# Altium schematic sheet Microphone.SchDoc
size A3; SheetNumber: 4; SheetTotal: 7
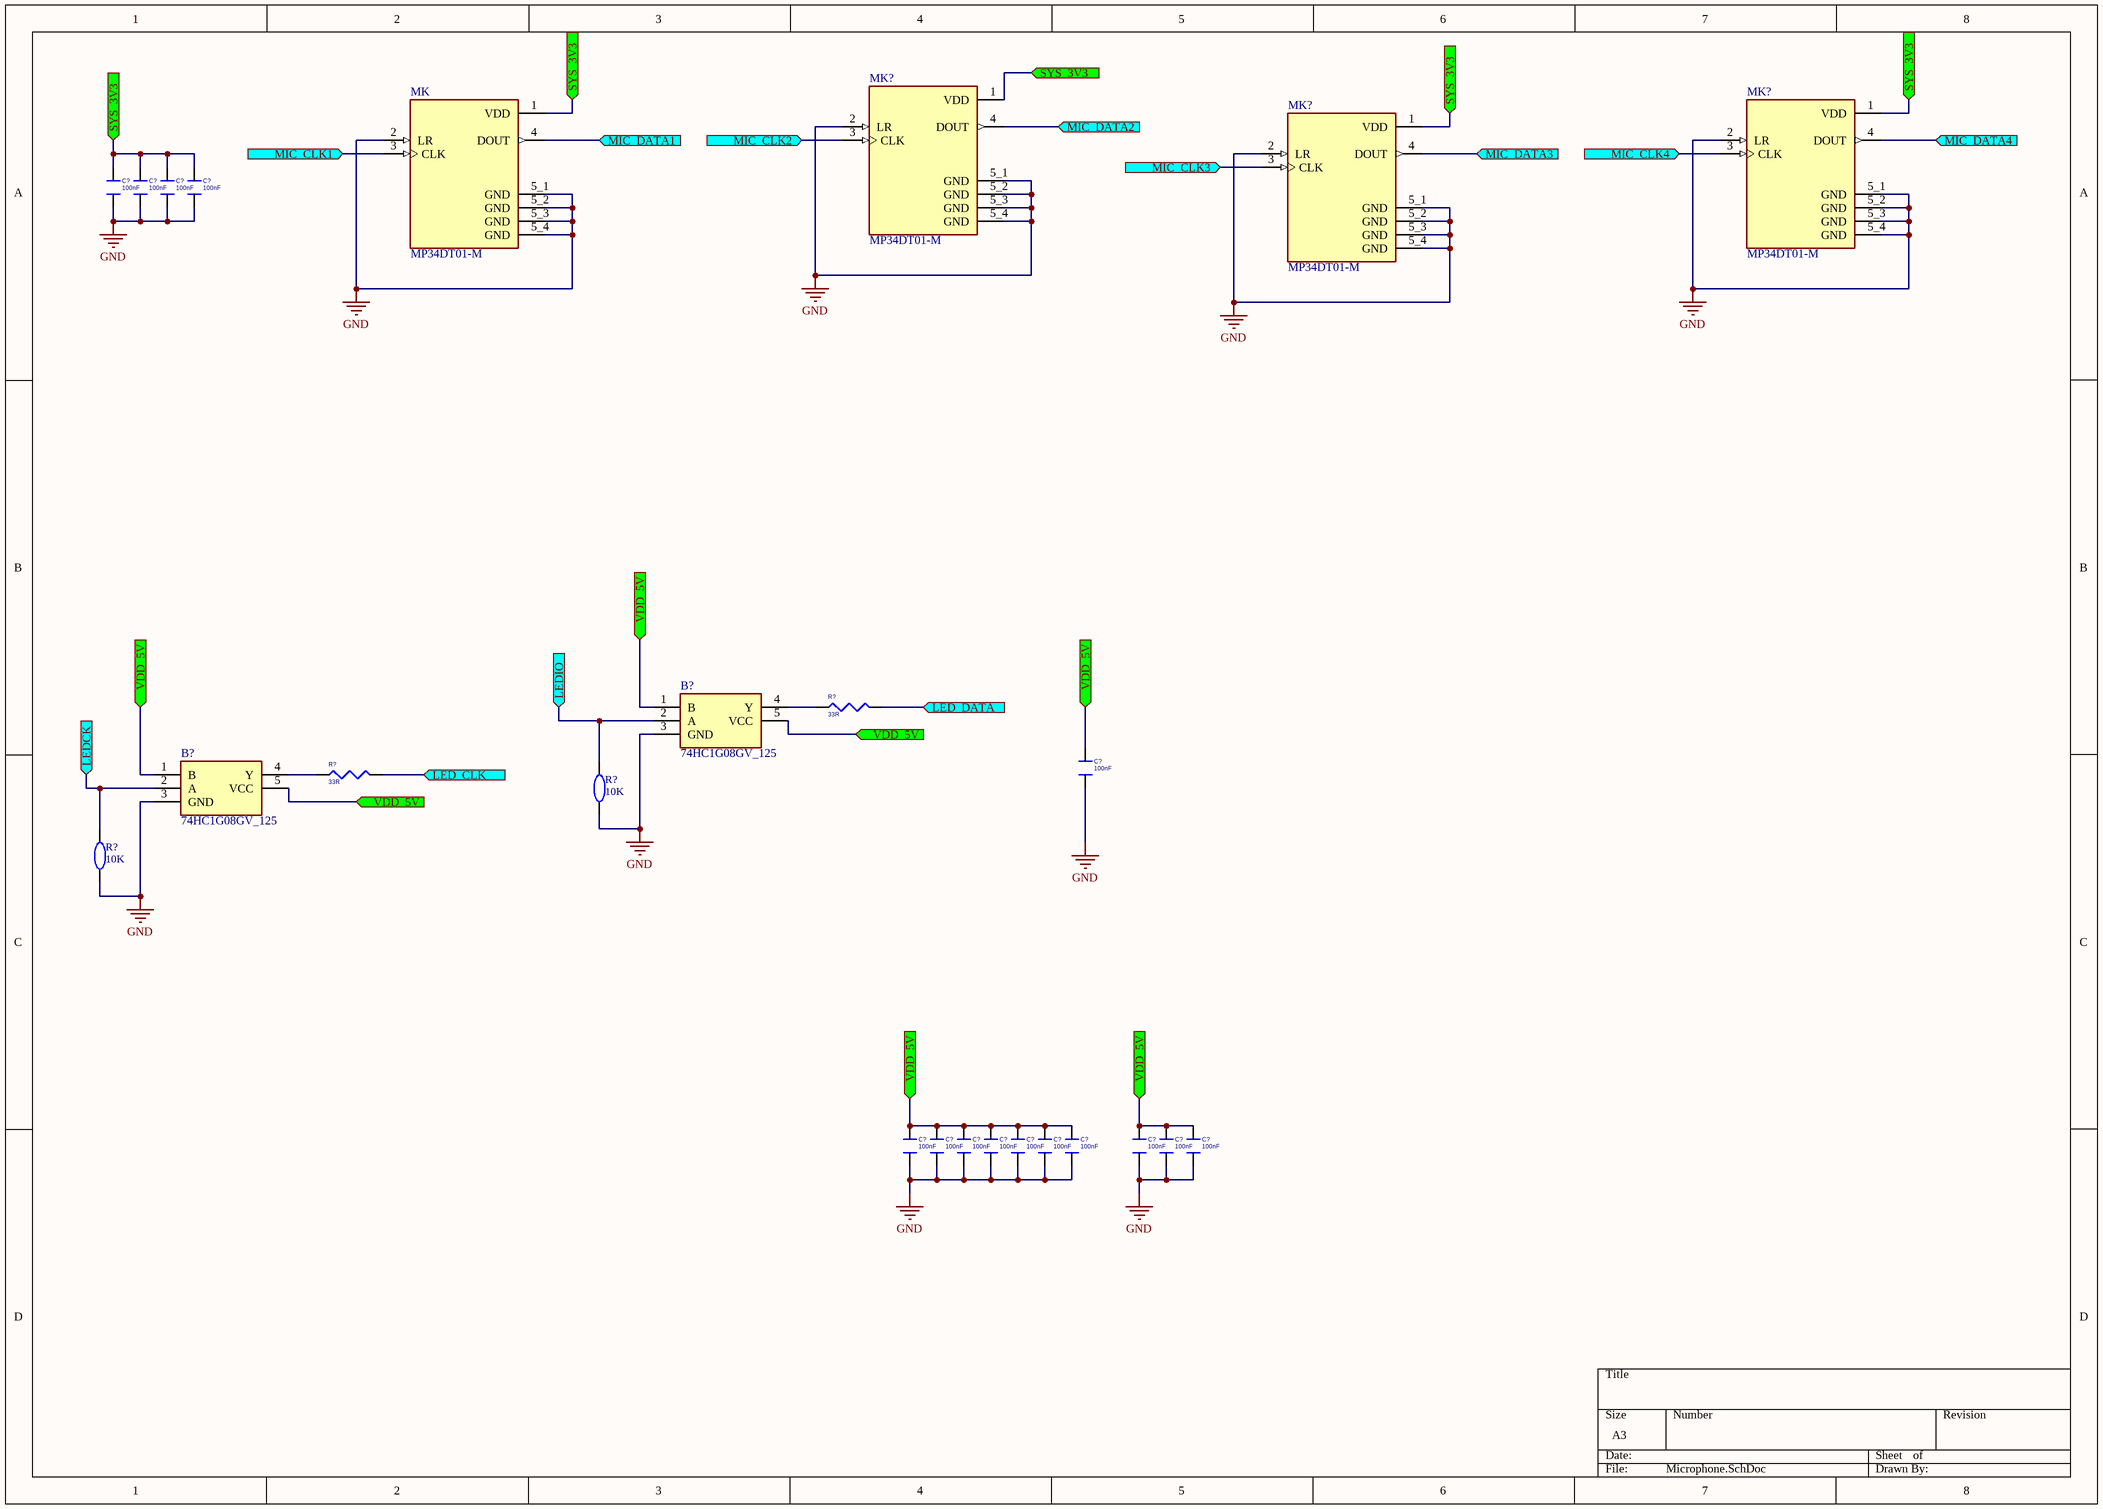
[diagram p0: Microphone.SchDoc]

## Parts
(Parts that share a designator on the sheet are numbered #1, #2 ... from top to bottom, then left to right.)
B?#1  74HC1G08GV_125  [SOT65P212X110-5N]
B?#2  74HC1G08GV_125  [SOT65P212X110-5N]
C?#1  100nF  [C0603]
C?#2  100nF  [C0603]
C?#3  100nF  [C0603]
C?#4  100nF  [C0603]
C?#5  100nF  [C0603]
C?#6  100nF  [C0603]
C?#7  100nF  [C0603]
C?#8  100nF  [C0603]
C?#9  100nF  [C0603]
C?#10  100nF  [C0603]
C?#11  100nF  [C0603]
C?#12  100nF  [C0603]
C?#13  100nF  [C0603]
C?#14  100nF  [C0603]
C?#15  100nF  [C0603]
MK  MP34DT01-M  [MIC_MP34DT01-M]
MK?#1  MP34DT01-M  [MIC_MP34DT01-M]
MK?#2  MP34DT01-M  [MIC_MP34DT01-M]
MK?#3  MP34DT01-M  [MIC_MP34DT01-M]
R?#1  33R  [R 0603]
R?#2  33R  [R 0603]
R?#3  Comment_1: 10K  [R 0603]  (hidden comment: 1K)
R?#4  Comment_1: 10K  [R 0603]  (hidden comment: 1K)

## Ports
LED_CLK (in), LED_DATA (in), LEDCK (in), LEDIO (in), MIC_CLK1 (in), MIC_CLK2 (in), MIC_CLK3 (in), MIC_CLK4 (in), MIC_DATA1 (in), MIC_DATA2 (in), MIC_DATA3 (in), MIC_DATA4 (in), SYS_3V3 (in), VDD_5V (in)

## Nets
GND: B?#1.3(GND) B?#2.3(GND) C?#1.1 C?#2.1 C?#3.1 C?#4.1 C?#5.1 C?#6.1 C?#7.1 C?#8.1 C?#9.1 C?#10.1 C?#11.1 C?#12.1 C?#13.1 C?#14.1 C?#15.1 MK.2(LR) MK.5_1(GND) MK.5_2(GND) MK.5_3(GND) MK.5_4(GND) MK?#1.2(LR) MK?#1.5_1(GND) MK?#1.5_2(GND) MK?#1.5_3(GND) MK?#1.5_4(GND) MK?#2.2(LR) MK?#2.5_1(GND) MK?#2.5_2(GND) MK?#2.5_3(GND) MK?#2.5_4(GND) MK?#3.2(LR) MK?#3.5_1(GND) MK?#3.5_2(GND) MK?#3.5_3(GND) MK?#3.5_4(GND) R?#3.1 R?#4.1
LED_CLK: R?#2.2 ; port LED_CLK
LED_DATA: R?#1.2 ; port LED_DATA
LEDCK: B?#2.2(A) R?#4.2 ; port LEDCK
LEDIO: B?#1.2(A) R?#3.2 ; port LEDIO
MIC_CLK1: MK.3(CLK) ; port MIC_CLK1
MIC_CLK2: MK?#1.3(CLK) ; port MIC_CLK2
MIC_CLK3: MK?#3.3(CLK) ; port MIC_CLK3
MIC_CLK4: MK?#2.3(CLK) ; port MIC_CLK4
MIC_DATA1: MK.4(DOUT) ; port MIC_DATA1
MIC_DATA2: MK?#1.4(DOUT) ; port MIC_DATA2
MIC_DATA3: MK?#3.4(DOUT) ; port MIC_DATA3
MIC_DATA4: MK?#2.4(DOUT) ; port MIC_DATA4
SYS_3V3: C?#1.2 C?#2.2 C?#3.2 C?#4.2 MK.1(VDD) MK?#1.1(VDD) MK?#2.1(VDD) MK?#3.1(VDD) ; port SYS_3V3
VDD_5V: B?#1.1(B) B?#1.5(VCC) B?#2.1(B) B?#2.5(VCC) C?#5.2 C?#6.2 C?#7.2 C?#8.2 C?#9.2 C?#10.2 C?#11.2 C?#12.2 C?#13.2 C?#14.2 C?#15.2 ; port VDD_5V
NetB?#1_4: B?#1.4(Y) R?#1.1
NetB?#2_4: B?#2.4(Y) R?#2.1

## Library data of the parts
B?#1 B?#2 = 74HC1G08GV_125: 74HC(T)1G08 - 2-input AND gate@en-us; Manufacturer_Name: Nexperia; Manufacturer_Part_Number: 74HC1G08GV,125; Geometry.Height: 1.1mm; Mouser Part Number: 771-74HC1G08GV; Mouser Price/Stock: https://www.mouser.co.uk/ProductDetail/Nexperia/74HC1G08GV125?qs=P62ublwmbi9shys2yLaZlQ%3D%3D; Arrow Part Number: 74HC1G08GV,125; Arrow Price/Stock: https://www.arrow.com/en/products/74hc1g08gv125/nexperia?region=nac; Datasheet Link: https://assets.nexperia.com/documents/data-sheet/74HC_HCT1G08.pdf
C?#1-C?#15 = CAPACITOR_0_Dup3: CAP ±20%/10V/X5R/SMT0603; PAGE: 1
MK MK?#1-MK?#3 = MP34DT01-M: MP34DT01-M MEMS Omnidirectional Microphones Audio Evaluation Board; MF: STMicroelectronics; Availability: Unavailable; Package: None; SnapEDA_Link: https://www.snapeda.com/parts/MP34DT01-M/STMicroelectronics/view-part/590970/?ref=snap; Price: None; MP: MP34DT01-M; Value: *
R?#1 R?#2 = R_Dup1: RES 1/16W 5% SMT0402
R?#3 R?#4 = 1.5K: Published: 8-Jun-2000; LatestRevisionDate: 17-Jul-2002; LatestRevisionNote: Re-released for DXP Platform.; PackageReference: AXIAL-0.4; Publisher: Altium Limited